# Altium schematic sheet 07_AC97_AUDIO.SchDoc: AC97 Audio with Optical SPDIF
size 381 x 266 mm; Organization: Meteroi; Address1: Room 428, 410 Guiping Rd.; Address2: Shanghai 200233, CHINA; SheetNumber: 7; SheetTotal: 9; PageSetup: Record=PageOptions|CenterHorizontal=True|CenterVertical=True|PrintScale=0.75|XCorrection=1.00|YCorrection=1.00|PrintKind=2|BorderSize=5000000|LeftOffset=0|BottomOffset=0|Orientation=2|PaperLength=1000|PaperWidth=1000|Scale=100|PaperSource=276|PrintQuality=-3|MediaType=1|DitherType=10|PaperKind=A4|PrintScaleMode=1
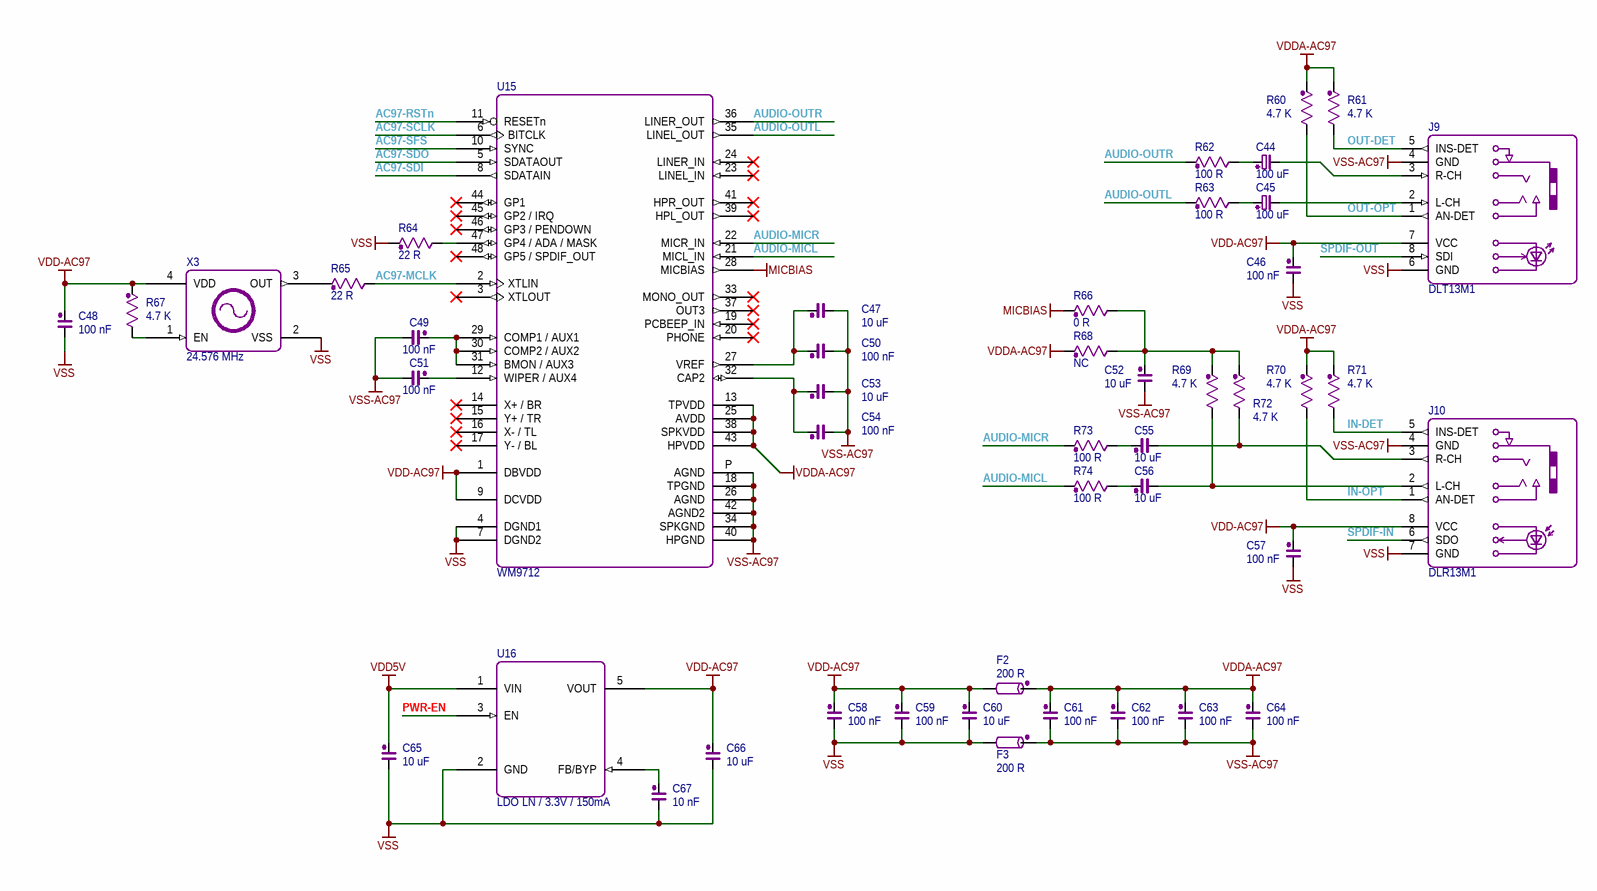
[diagram p0: 07_AC97_AUDIO.SchDoc]

## Parts
C44  100 uF  [CAP_EB]
C45  100 uF  [CAP_EB]
C46  100 nF  [0603A1]
C47  10 uF  [0603A1]
C48  100 nF  [0402A1]
C49  100 nF  [0402A1]
C50  100 nF  [0402A1]
C51  100 nF  [0402A1]
C52  10 uF  [0603A1]
C53  10 uF  [0603A1]
C54  100 nF  [0402A1]
C55  10 uF  [1210A1]
C56  10 uF  [1210A1]
C57  100 nF  [0603A1]
C58  100 nF  [0402A1]
C59  100 nF  [0402A1]
C60  10 uF  [0603A1]
C61  100 nF  [0402A1]
C62  100 nF  [0402A1]
C63  100 nF  [0402A1]
C64  100 nF  [0402A1]
C65  10 uF  [0603A1]
C66  10 uF  [0603A1]
C67  10 nF  [0402A1]
F2  200 R  [0603A3]
F3  200 R  [0603A3]
J9  DLT13M1  [DLT13M1]
J10  DLR13M1  [DLR13M1]
R60  4.7 K  [0603A2]
R61  4.7 K  [0603A2]
R62  100 R  [0603A2]
R63  100 R  [0603A2]
R64  22 R  [0402A2]
R65  22 R  [0402A2]
R66  0 R  [0603A2]
R67  4.7 K  [0402A2]
R68  NC  [0603A2]
R69  4.7 K  [0603A2]
R70  4.7 K  [0603A2]
R71  4.7 K  [0603A2]
R72  4.7 K  [0603A2]
R73  100 R  [0603A2]
R74  100 R  [0603A2]
U15  WM9712  [QFN-7-48]
U16  LDO LN / 3.3V / 150mA  [SOT-23-5]
X3  24.576 MHz  [OSC_4B_S_5032]

## Nets
MICBIAS: R66.2 U15.28(MICBIAS)
VDD5V: C65.2 U16.1(VIN)
VDD-AC97: C46.2 C48.2 C57.2 C58.2 C59.2 C60.2 C66.2 F2.1 J9.7(VCC) J10.8(VCC) R67.2 U15.1(DBVDD) U15.9(DCVDD) U16.5(VOUT) X3.4(VDD)
VDDA-AC97: C61.2 C62.2 C63.2 C64.2 F2.2 R60.2 R61.2 R68.2 R70.2 R71.2 U15.13(TPVDD) U15.25(AVDD) U15.38(SPKVDD) U15.43(HPVDD)
VSS: C46.1 C48.1 C57.1 C58.1 C59.1 C60.1 C65.1 C66.1 C67.1 F3.1 J9.6(GND) J10.7(GND) R64.2 U15.4(DGND1) U15.7(DGND2) U16.2(GND) X3.2(VSS)
VSS-AC97: C47.1 C49.1 C50.1 C51.1 C52.1 C53.1 C54.1 C61.1 C62.1 C63.1 C64.1 F3.2 J9.4(GND) J10.4(GND) U15.18(TPGND) U15.26(AGND) U15.34(SPKGND) U15.40(HPGND) U15.42(AGND2) U15.P(AGND)
AC97-MCLK: R65.1 U15.2(XTLIN)
AC97-RSTn: U15.11(RESETn)
AC97-SCLK: U15.6(BITCLK)
AC97-SDI: U15.8(SDATAIN)
AC97-SDO: U15.5(SDATAOUT)
AC97-SFS: U15.10(SYNC)
AUDIO-MICL: R74.2 U15.21(MICL_IN)
AUDIO-MICR: R73.2 U15.22(MICR_IN)
AUDIO-OUTL: R63.2 U15.35(LINEL_OUT)
AUDIO-OUTR: R62.2 U15.36(LINER_OUT)
IN-DET: J10.5(INS-DET) R71.1
IN-OPT: J10.1(AN-DET) R70.1
OUT-DET: J9.5(INS-DET) R61.1
OUT-OPT: J9.1(AN-DET) R60.1
PWR-EN: U16.3(EN)
SPDIF-IN: J10.6(SDO)
SPDIF-OUT: J9.8(SDI)
NetC44_1: C44.1 J9.3(R-CH)
NetC44_2: C44.2 R62.1
NetC45_1: C45.1 J9.2(L-CH)
NetC45_2: C45.2 R63.1
NetC47_2: C47.2 C50.2 U15.27(VREF)
NetC49_2: C49.2 U15.29(COMP1_/_AUX1) U15.30(COMP2_/_AUX2) U15.31(BMON_/_AUX3)
NetC51_2: C51.2 U15.12(WIPER_/_AUX4)
NetC52_2: C52.2 R66.1 R68.1 R69.2 R72.2
NetC53_2: C53.2 C54.2 U15.32(CAP2)
NetC55_1: C55.1 J10.3(R-CH) R72.1
NetC55_2: C55.2 R73.1
NetC56_1: C56.1 J10.2(L-CH) R69.1
NetC56_2: C56.2 R74.1
NetC67_2: C67.2 U16.4(FB/BYP)
NetR64_1: R64.1 U15.47(GP4_/_ADA_/_MASK)
NetR65_2: R65.2 X3.3(OUT)
NetR67_1: R67.1 X3.1(EN)

Not connected (* = marked no-connect by the designer): U15 3(XTLOUT)* 14(X+_/_BR)* 15(Y+_/_TR)* 16(X-_/_TL)* 17(Y-_/_BL)* 19(PCBEEP_IN)* 20(PHONE)* 23(LINEL_IN)* 24(LINER_IN)* 33(MONO_OUT)* 37(OUT3)* 39(HPL_OUT)* 41(HPR_OUT)* 44(GP1)* 45(GP2_/_IRQ)* 46(GP3_/_PENDOWN)* 48(GP5_/_SPDIF_OUT)*

## Notes on the sheet
- Title:
- Project:
- Sheet:
- Of
- Size:
- D/N:
- Rev:
- Date:
- P/N:
- S/N:
- Designer:
- C

## Library data of the parts
C44 C45 = CAP_E: Electrolyte Capacitor; PartNumber: 0; Designer: shyul; Vendor: AVX; PinCountSMD: 2; SerialNumber: 0; PCBMarker: Capacitor; Publisher: Cowin; Value: 100 uF; Version: 1.0; VersionDate: 04-27-2011; PinCountHole: 0
C46-C67 = CAP: Normal Capacitor; PartNumber: 0; Vendor: muRata; Designer: shyul; PinCountSMD: 2; SerialNumber: 0; Publisher: Cowin; PCBMarker: Capacitor; Version: 1.0; VersionDate: 04-27-2011; PinCountHole: 0
  C46 C48-C51 C54 C57-C59 C61-C64: Value: 100 nF
  C47 C52 C53 C55 C56 C60 C65 C66: Value: 10 uF
  C67: Value: 10 nF
F2 F3 = BEAD: EMI Bead; PartNumber: BLM; SerialNumber: 0; Vendor: muRata; Designer: shyul; PinCountSMD: 2; PCBMarker: Bead; Version: 1.0; Value: 200 R; VersionDate: 04-28-2011; Publisher: Cowin; PinCountHole: 0
J9 = DLT13M1: 3.5mm Audio Jack with SPDIF Optical Output; Vendor: Ax-Edison; PinCountSMD: 0; PinCountHole: 9; Designer: shyul; PCBMarker: Audio Out; Value: DLT13M1; PartNumber: DLT13M1; Version: 1.0; VersionDate: 03-16-2012; SerialNumber: 0; Publisher: Cowin
J10 = DLR13M1: 3.5mm Audio Jack with SPDIF Optical Input; Vendor: Ax-Edison; PinCountSMD: 0; PinCountHole: 9; Designer: shyul; PCBMarker: Audio Out; Value: DLR13M1; PartNumber: DLR13M1; Version: 1.0; VersionDate: 03-16-2012; SerialNumber: 0; Publisher: Cowin
R60-R74 = RES: Normal Resistor; PartNumber: 0; Vendor: KOA; Designer: shyul; PinCountSMD: 2; SerialNumber: 0; Version: 1.0; VersionDate: 04-27-2011; PCBMarker: Resistor; Publisher: Cowin; PinCountHole: 0
  R60 R61 R67 R69-R72: Value: 4.7 K
  R62 R63 R73 R74: Value: 100 R
  R64 R65: Value: 22 R
  R66: Value: 0 R
  R68: Value: NC
U15 = WM9712: WM9712 AC97 Codec; PartNumber: WM9712LGEFL; Vendor: Wolfson; PinCountSMD: 49; PinCountHole: 0; Designer: shyul; Value: WM9712; Version: 1.0; VersionDate: 07-06-2012; SerialNumber: 0; Publisher: Cowin; PCBMarker: AC97
U16 = MIC5265: Low Noise LDO 150mA; PartNumber: MIC5265-3.3YD5; Vendor: Micrel; PinCountSMD: 5; PinCountHole: 0; Designer: shyul; Value: LDO LN / 3.3V / 150mA; Version: 1.0; VersionDate: 05-08-2011; SerialNumber: 0; Publisher: Cowin; PCBMarker: LDO; Supplier 1: Digi-Key; Supplier Part Number 1: 576-2835-2-ND
X3 = OSC_4B: Crystal Oscillator; PartNumber: 0; Vendor: KDS; Designer: shyul; Value: 24.576 MHz; SerialNumber: 0; Publisher: Cowin; PCBMarker: Crystal Oscillator; Version: 1.0; VersionDate: 04-29-2011